# EasyEDA Pro project Sensor_colis_examples.epro, board 2024-06-03_06-21-20
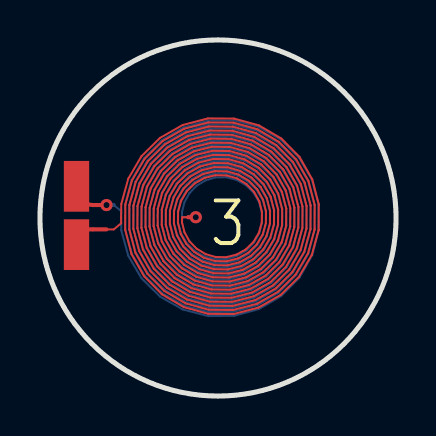
[diagram p4: board, top side]
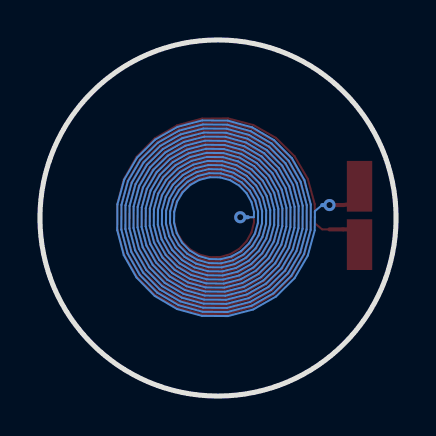
[diagram p5: board, bottom side, seen from below]

Outline 17.83 x 17.83 mm; copper layers: Top Layer, Bottom Layer. Coordinates in mm from the lower left corner of the outline.
Outline path: circle c8.92,8.92 r8.92
Stack: Top Layer 0.035mm - / Dielectric1 1.51mm FR4 er 4.5 / Bottom Layer 0.035mm -

## Design rules (mm)
template: 用户自定义配置
spacing safeClearance (default): track to track 0.152, other pairs 0.152 to 0.3
track width trackWidth (default): min 0.025, default 0.254, max 2.54
differential pair differentialPair (default): width min 0.127, default 0.254, max 2.54; gap min 0.152, default 0.152
via viaSize (default): diameter min 0.5, default 0.61, max 10; hole min 0.3, default 0.305, max 5.999

## Placement (name value [footprint] x y rotation side)
CSENSOR  -  [0603]  1.83 9.3 90 top

## Footprints (pads in the part's own frame, mm; a bottom-side part is the same pattern mirrored in y, then rotated)
0603
  rect 2.54x1.27 smd: 1(-1.714,0) 2(1.206,0)

## Nets
3: CSENSOR.1 CSENSOR.2

## Via types
v1: diameter 0.61, hole 0.305, Top Layer to Bottom Layer, 2 vias

## Routing (per net, layer and track width the routed paths; a pad name or vN(x,y) marks a point on that pad's centre or on a via; arc(x,y) is an arc through that point)
3: length 664.4
  Top Layer w0.102: 7.42,8.96 7.12,8.96 7.11,8.7 7.24,8.2 7.49,7.75 7.85,7.37 8.3,7.11 8.8,6.96 9.33,6.95 9.84,7.08 10.31,7.34 10.69,7.71 10.96,8.17 11.11,8.69 11.12,9.23 10.99,9.75 10.72,10.23 10.34,10.62 9.87,10.9 9.34,11.05 8.79,11.06 8.25,10.92 7.76,10.65 7.36,10.26 7.07,9.78 6.92,9.24 6.91,8.67 7.05,8.12 7.33,7.62 7.73,7.21 8.22,6.92 8.78,6.76 9.36,6.75 9.92,6.89 10.43,7.18 10.85,7.59 11.15,8.09 11.31,8.66 11.32,9.25 11.18,9.83 10.88,10.35 10.47,10.78 9.95,11.09 9.37,11.25 8.76,11.26 8.17,11.11 7.64,10.82 7.2,10.39 6.88,9.86 6.72,9.27 6.71,8.65 6.86,8.04 7.16,7.5 7.6,7.05 8.14,6.73 8.75,6.56 9.38,6.55 10,6.7 10.55,7.02 11.01,7.46 11.34,8.01 11.52,8.63 11.52,9.28 11.37,9.91 11.05,10.48 10.59,10.94 10.03,11.28 9.39,11.46 8.73,11.47 8.09,11.3 7.51,10.98 7.04,10.51 6.69,9.94 6.51,9.29 6.5,8.62 6.67,7.96 7,7.37 7.48,6.89 8.06,6.54 8.72,6.35 9.41,6.34 10.08,6.51 10.68,6.85 11.18,7.34 11.53,7.93 11.72,8.61 11.73,9.31 11.55,9.99 11.21,10.6 10.72,11.11 10.11,11.47 9.42,11.66 8.71,11.67 8.01,11.49 7.39,11.14 6.87,10.64 6.5,10.02 6.31,9.32 6.3,8.59 6.48,7.89 6.84,7.25 7.35,6.72 7.98,6.35 8.7,6.15 9.44,6.14 10.16,6.33 10.8,6.69 11.34,7.21 11.72,7.86 11.92,8.58 11.93,9.33 11.74,10.07 11.37,10.73 10.84,11.27 10.18,11.66 9.45,11.86 8.68,11.87 7.94,11.68 7.26,11.3 6.71,10.76 6.32,10.09 6.11,9.35 6.1,8.57 6.29,7.81 6.68,7.12 7.23,6.56 7.91,6.16 8.67,5.95 9.46,5.94 10.23,6.14 10.93,6.53 11.5,7.09 11.91,7.78 12.13,8.55 12.13,9.36 11.93,10.14 11.53,10.85 10.97,11.43 10.26,11.85 9.47,12.07 8.65,12.08 7.86,11.87 7.14,11.47 6.55,10.89 6.13,10.17 5.9,9.37 5.89,8.54 6.1,7.73 6.51,7 7.1,6.4 7.83,5.97 8.64,5.74 9.49,5.73 10.31,5.95 11.05,6.36 11.66,6.96 12.1,7.7 12.33,8.53 12.34,9.39 12.12,10.22 11.7,10.98 11.09,11.59 10.34,12.04 9.5,12.27 8.63,12.28 7.78,12.06 7.01,11.63 6.39,11.01 5.94,10.25 5.7,9.4 5.69,8.51 5.91,7.65 6.35,6.87 6.98,6.24 7.75,5.78 8.62,5.54 9.52,5.53 10.39,5.76 11.18,6.2 11.83,6.84 12.29,7.62 12.53,8.5 12.54,9.41 12.31,10.3 11.86,11.1 11.21,11.76 10.42,12.23 9.53,12.47 8.6,12.48 7.7,12.25 6.89,11.79 6.22,11.14 5.75,10.33 5.5,9.43 5.49,8.48 5.72,7.57 6.19,6.75 6.85,6.07 7.67,5.59 8.59,5.34 9.54,5.33 10.47,5.57 11.3,6.04 11.99,6.71 12.48,7.54 12.73,8.47 12.74,9.44 12.5,10.38 12.02,11.22 11.34,11.92 10.5,12.42 9.56,12.68 8.57,12.69 7.62,12.44 6.76,11.95 6.06,11.26 5.56,10.41 5.29,9.45 5.28,8.46 5.53,7.49 6.03,6.62 6.73,5.91 7.59,5.4 8.56,5.13 9.57,5.12 10.55,5.38 11.43,5.88 12.15,6.59 12.67,7.46 12.94,8.45 12.95,9.47 12.69,10.46 12.19,11.35 11.46,12.08 10.58,12.61 9.58,12.88 8.55,12.89 7.54,12.63 6.64,12.12 5.9,11.39 5.37,10.49 5.09,9.48 5.08,8.43 5.34,7.41 5.86,6.5 6.6,5.75 7.51,5.21 8.53,4.93 9.6,4.92 10.63,5.19 11.55,5.71 12.31,6.46 12.86,7.39 13.14,8.42 13.15,9.49 12.88,10.54 12.35,11.47 11.59,12.24 10.66,12.79 9.61,13.08 8.52,13.09 7.47,12.82 6.51,12.28 5.73,11.51 5.18,10.57 4.89,9.51 4.88,8.41 5.16,7.34 5.7,6.38 6.48,5.59 7.44,5.02 8.51,4.73 9.62,4.72 10.7,5 11.68,5.55 12.48,6.34 13.05,7.31 13.34,8.39 13.35,9.52 13.07,10.61 12.51,11.6 11.71,12.41 10.73,12.98 9.63,13.29 8.49,13.3 7.39,13.01 6.39,12.44 5.57,11.64 4.99,10.64 4.68,9.53 4.67,8.38 4.97,7.26 5.54,6.25 6.35,5.42 7.36,4.83 8.48,4.52 9.65,4.52 10.78,4.81 11.8,5.39 12.64,6.21 13.23,7.23 13.55,8.37 13.56,9.55 13.26,10.69 12.67,11.72 11.84,12.57 10.81,13.17 9.66,13.49 8.47,13.5 7.31,13.2 6.27,12.6 5.41,11.76 4.8,10.72 4.48,9.56 4.47,8.35 4.78,7.18 5.38,6.13 6.23,5.26 7.28,4.64 8.45,4.32 9.68,4.31 10.86,4.62 11.93,5.23 12.8,6.09 13.42,7.15 13.75,8.34 13.76,9.57 13.45,10.77 12.84,11.85 11.96,12.73 10.89,13.36 9.69,13.69 8.44,13.7 7.23,13.39 6.14,12.77 5.25,11.89 4.61,10.8 4.28,9.59 4.27,8.32 4.59,7.1 5.21,6 6.1,5.1 7.2,4.45 8.43,4.12 9.7,4.11 10.94,4.43 12.05,5.06 12.96,5.96 13.61,7.07 13.95,8.31 13.96,9.6 13.64,10.85 13,11.97 12.09,12.9 10.97,13.55 9.72,13.9 8.41,13.9 7.15,13.58 6.02,12.93 5.08,12.01 4.42,10.88 4.07,9.61 4.07,8.96 4.07,8.65 3.7,8.35 3.33,8.35
  Top Layer w0.203: v1(3.33,9.57) 2.65,9.57 1.97,9.65 1.97,9.74 ; 1.97,8.35 3.33,8.35 ; 7.42,8.96 7.72,8.96
  Bottom Layer w0.102: 7.42,8.96 7.12,8.96 7.11,9.21 7.24,9.71 7.49,10.16 7.85,10.54 8.3,10.81 8.8,10.95 9.33,10.96 9.84,10.83 10.31,10.57 10.69,10.2 10.96,9.74 11.11,9.22 11.12,8.69 10.99,8.16 10.72,7.69 10.34,7.29 9.87,7.01 9.34,6.86 8.79,6.85 8.25,6.99 7.76,7.26 7.36,7.65 7.07,8.13 6.92,8.67 6.91,9.24 7.05,9.79 7.33,10.29 7.73,10.7 8.22,11 8.78,11.15 9.36,11.16 9.92,11.02 10.43,10.73 10.85,10.33 11.15,9.82 11.31,9.25 11.32,8.66 11.18,8.08 10.88,7.56 10.47,7.13 9.95,6.82 9.37,6.66 8.76,6.65 8.17,6.8 7.64,7.1 7.2,7.52 6.88,8.05 6.72,8.65 6.71,9.27 6.86,9.87 7.16,10.41 7.6,10.86 8.14,11.19 8.75,11.36 9.38,11.36 10,11.21 10.55,10.9 11.01,10.45 11.34,9.9 11.52,9.28 11.52,8.63 11.37,8 11.05,7.44 10.59,6.97 10.03,6.63 9.39,6.45 8.73,6.45 8.09,6.61 7.51,6.93 7.04,7.4 6.69,7.97 6.51,8.62 6.5,9.29 6.67,9.95 7,10.54 7.48,11.03 8.06,11.37 8.72,11.56 9.41,11.57 10.08,11.4 10.68,11.06 11.18,10.58 11.53,9.98 11.72,9.31 11.73,8.61 11.55,7.92 11.21,7.31 10.72,6.8 10.11,6.44 9.42,6.25 8.71,6.24 8.01,6.42 7.39,6.77 6.87,7.27 6.5,7.9 6.31,8.59 6.3,9.32 6.48,10.03 6.84,10.66 7.35,11.19 7.98,11.56 8.7,11.76 9.44,11.77 10.16,11.59 10.8,11.22 11.34,10.7 11.72,10.06 11.92,9.33 11.93,8.58 11.74,7.85 11.37,7.19 10.84,6.64 10.18,6.25 9.45,6.05 8.68,6.04 7.94,6.23 7.26,6.61 6.71,7.15 6.32,7.82 6.11,8.57 6.1,9.35 6.29,10.1 6.68,10.79 7.23,11.35 7.91,11.75 8.67,11.97 9.46,11.97 10.23,11.78 10.93,11.38 11.5,10.83 11.91,10.13 12.13,9.36 12.13,8.55 11.93,7.77 11.53,7.06 10.97,6.48 10.26,6.06 9.47,5.84 8.65,5.84 7.86,6.04 7.14,6.45 6.55,7.02 6.13,7.74 5.9,8.54 5.89,9.37 6.1,10.18 6.51,10.91 7.1,11.51 7.83,11.94 8.64,12.17 9.49,12.18 10.31,11.97 11.05,11.55 11.66,10.95 12.1,10.21 12.33,9.39 12.34,8.52 12.12,7.69 11.7,6.94 11.09,6.32 10.34,5.88 9.5,5.64 8.63,5.63 7.78,5.85 7.01,6.28 6.39,6.9 5.94,7.66 5.7,8.51 5.69,9.4 5.91,10.26 6.35,11.04 6.98,11.68 7.75,12.13 8.62,12.37 9.52,12.38 10.39,12.16 11.18,11.71 11.83,11.07 12.29,10.29 12.53,9.41 12.54,8.5 12.31,7.61 11.86,6.81 11.21,6.15 10.42,5.69 9.53,5.44 8.6,5.43 7.7,5.66 6.89,6.12 6.22,6.77 5.75,7.58 5.5,8.49 5.49,9.43 5.72,10.34 6.19,11.16 6.85,11.84 7.67,12.32 8.59,12.58 9.54,12.58 10.47,12.34 11.3,11.87 11.99,11.2 12.48,10.37 12.73,9.44 12.74,8.47 12.5,7.53 12.02,6.69 11.34,5.99 10.5,5.5 9.56,5.23 8.57,5.23 7.62,5.47 6.76,5.96 6.06,6.65 5.56,7.5 5.29,8.46 5.28,9.45 5.53,10.42 6.03,11.29 6.73,12 7.59,12.51 8.56,12.78 9.57,12.79 10.55,12.53 11.43,12.03 12.15,11.32 12.67,10.45 12.94,9.47 12.95,8.44 12.69,7.45 12.19,6.56 11.46,5.83 10.58,5.31 9.58,5.03 8.55,5.02 7.54,5.28 6.64,5.8 5.9,6.53 5.37,7.42 5.09,8.43 5.08,9.48 5.34,10.5 5.86,11.41 6.6,12.16 7.51,12.7 8.53,12.98 9.6,12.99 10.63,12.72 11.55,12.2 12.31,11.45 12.86,10.53 13.14,9.49 13.15,8.42 12.88,7.38 12.35,6.44 11.59,5.67 10.66,5.12 9.61,4.83 8.52,4.82 7.47,5.09 6.51,5.63 5.73,6.4 5.18,7.35 4.89,8.41 4.88,9.51 5.16,10.58 5.7,11.54 6.48,12.33 7.44,12.89 8.51,13.19 9.62,13.19 10.7,12.91 11.68,12.36 12.48,11.57 13.05,10.6 13.34,9.52 13.35,8.39 13.07,7.3 12.51,6.31 11.71,5.5 10.73,4.93 9.63,4.63 8.49,4.62 7.39,4.9 6.39,5.47 5.57,6.28 4.99,7.27 4.68,8.38 4.67,9.53 4.97,10.65 5.54,11.66 6.35,12.49 7.36,13.08 8.48,13.39 9.65,13.4 10.78,13.1 11.8,12.52 12.64,11.7 13.23,10.68 13.55,9.55 13.56,8.36 13.26,7.22 12.67,6.19 11.84,5.34 10.81,4.74 9.66,4.42 8.47,4.41 7.31,4.72 6.27,5.31 5.41,6.15 4.8,7.19 4.48,8.35 4.47,9.56 4.78,10.73 5.38,11.79 6.23,12.65 7.28,13.27 8.45,13.59 9.68,13.6 10.86,13.29 11.93,12.69 12.8,11.82 13.42,10.76 13.75,9.57 13.76,8.34 13.45,7.14 12.84,6.06 11.96,5.18 10.89,4.55 9.69,4.22 8.44,4.21 7.23,4.53 6.14,5.14 5.25,6.03 4.61,7.11 4.28,8.33 4.27,9.59 4.59,10.81 5.21,11.91 6.1,12.81 7.2,13.46 8.43,13.79 9.7,13.8 10.94,13.48 12.05,12.85 12.96,11.95 13.61,10.84 13.95,9.6 13.96,8.31 13.64,7.06 13,5.94 12.09,5.02 10.97,4.36 9.72,4.02 8.41,4.01 7.15,4.34 6.02,4.98 5.08,5.9 4.42,7.03 4.07,8.3 4.07,8.96 4.07,9.26 3.7,9.57
  Bottom Layer w0.203: 7.42,8.96 7.72,8.96 ; 3.7,9.57 v1(3.33,9.57)
  vias: v1(7.8,8.96)

## Text on the board
Top Silkscreen Layer: Layers = 2 | Turns = 15 | Version - 1.1 | -------------- | Design Id - 105 | Coil Parameters | Customized for LDC1612 | Trace Width = 4.0 mils | Layer Stack Information | Trace Spacing = 4.0 mils | ------------------------- | WEBENCH Design Information | Copper thickness = 1.0 Oz-Cu | Exported on - 2024/06/03 06:21:18 | Inner Diameter = 154 mils (Approx.) | Outer Diameter = 394 mils (Approx.) | Space between TOP and BOTTOM = 4.0 mils | Exported from WEBENCH Coil Designer Tool | 3
